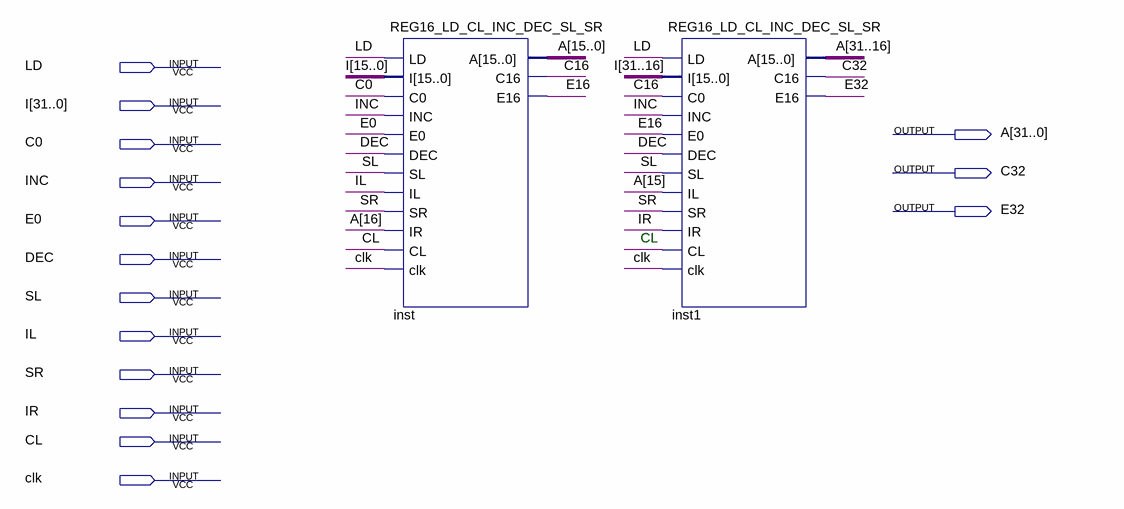
[diagram p0: schematic sheet]
// Quartus schematic REG32_LD_CL_INC_DEC_SL_SR.bdf as structural Verilog: 2 symbols, 15 pins
module REG32_LD_CL_INC_DEC_SL_SR (
  input  LD,
  input  [31:0] I,
  input  C0,
  input  INC,
  input  E0,
  input  DEC,
  input  SL,
  input  IL,
  input  SR,
  input  IR,
  input  CL,
  input  clk,
  output [31:0] A,
  output C32,
  output E32
);

  wire C16, E16;

  REG16_LD_CL_INC_DEC_SL_SR inst (
    .LD(LD), .I(I[15:0]), .C0(C0), .INC(INC), .E0(E0), .DEC(DEC), .SL(SL), .IL(IL), .SR(SR), .IR(A[16]),
    .CL(CL), .clk(clk), .A(A[15:0]), .C16(C16), .E16(E16));
  REG16_LD_CL_INC_DEC_SL_SR inst1 (
    .LD(LD), .I(I[31:16]), .C0(C16), .INC(INC), .E0(E16), .DEC(DEC), .SL(SL), .IL(A[15]), .SR(SR), .IR(IR),
    .CL(CL), .clk(clk), .A(A[31:16]), .C16(C32), .E16(E32));

  // Notes on the sheet:
  //   CL
endmodule
